# Altium project SNES_DRONE_V01.PrjPcb
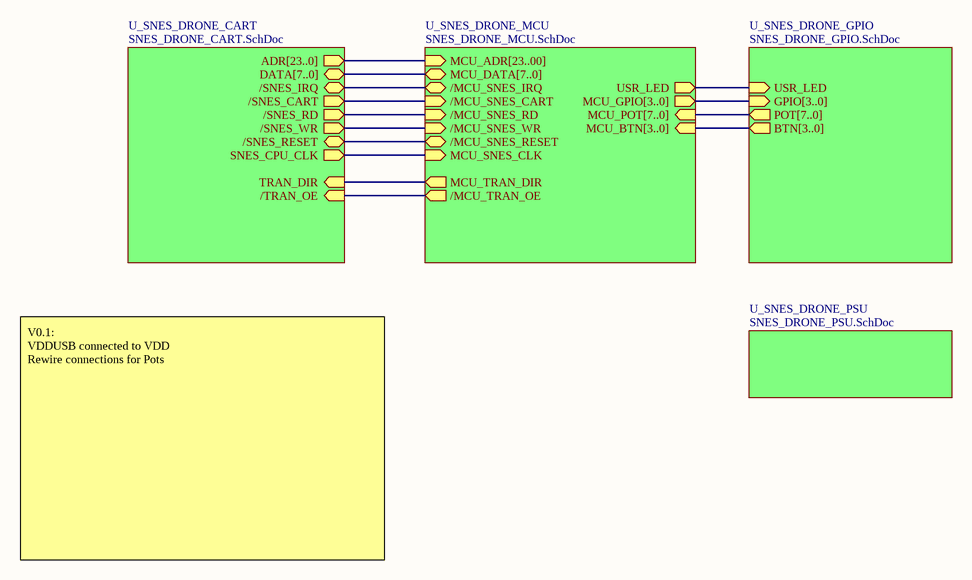
[diagram p0: SNES_DRONE_MAIN.SchDoc]
5 sheets, 102 parts. Net scope: hierarchical (ports join the sheet entries above them; power ports are global).
Board file: SNES_DRONE_PCB.PcbDoc
Sheets:
  SNES_DRONE_MAIN.SchDoc
    U_SNES_DRONE_CART = SNES_DRONE_CART.SchDoc
    U_SNES_DRONE_GPIO = SNES_DRONE_GPIO.SchDoc
    U_SNES_DRONE_MCU = SNES_DRONE_MCU.SchDoc
    U_SNES_DRONE_PSU = SNES_DRONE_PSU.SchDoc

## Sheet SNES_DRONE_MAIN.SchDoc
size A4

### Sub-sheets
U_SNES_DRONE_CART = SNES_DRONE_CART.SchDoc: DATA[7..0] (bidir), ADR[23..0] (out), /SNES_CART (out), /SNES_RD (out), /SNES_WR (out), SNES_CPU_CLK (out), TRAN_DIR (in), /TRAN_OE (in), /SNES_IRQ (bidir), /SNES_RESET (bidir)
U_SNES_DRONE_GPIO = SNES_DRONE_GPIO.SchDoc: POT[7..0] (out), BTN[3..0] (out), GPIO[3..0] (in), USR_LED (in)
U_SNES_DRONE_MCU = SNES_DRONE_MCU.SchDoc: MCU_ADR[23..00] (in), MCU_DATA[7..0] (bidir), /MCU_TRAN_OE (out), MCU_TRAN_DIR (out), /MCU_SNES_CART (in), /MCU_SNES_RD (in), /MCU_SNES_WR (in), MCU_SNES_CLK (in), MCU_POT[7..0] (in), USR_LED (out), MCU_GPIO[3..0] (out), MCU_BTN[3..0] (in), /MCU_SNES_IRQ (bidir), /MCU_SNES_RESET (bidir)
U_SNES_DRONE_PSU = SNES_DRONE_PSU.SchDoc: no entries

### Nets
MCU_USR_LED: sheet U_SNES_DRONE_GPIO/USR_LED, sheet U_SNES_DRONE_MCU/USR_LED
NetJ1_18: sheet U_SNES_DRONE_CART//SNES_IRQ, sheet U_SNES_DRONE_MCU//MCU_SNES_IRQ
NetJ1_23: sheet U_SNES_DRONE_CART//SNES_RD, sheet U_SNES_DRONE_MCU//MCU_SNES_RD
NetJ1_26: sheet U_SNES_DRONE_CART//SNES_RESET, sheet U_SNES_DRONE_MCU//MCU_SNES_RESET
NetJ1_49: sheet U_SNES_DRONE_CART//SNES_CART, sheet U_SNES_DRONE_MCU//MCU_SNES_CART
NetJ1_54: sheet U_SNES_DRONE_CART//SNES_WR, sheet U_SNES_DRONE_MCU//MCU_SNES_WR
NetJ1_57: sheet U_SNES_DRONE_CART/SNES_CPU_CLK, sheet U_SNES_DRONE_MCU/MCU_SNES_CLK
NetU2_35: sheet U_SNES_DRONE_CART//TRAN_OE, sheet U_SNES_DRONE_MCU//MCU_TRAN_OE
NetU2_36: sheet U_SNES_DRONE_CART/TRAN_DIR, sheet U_SNES_DRONE_MCU/MCU_TRAN_DIR

### Buses and harness runs
bus sheet U_SNES_DRONE_CART/ADR[23..0] = sheet U_SNES_DRONE_MCU/MCU_ADR[23..00]
bus sheet U_SNES_DRONE_CART/DATA[7..0] = sheet U_SNES_DRONE_MCU/MCU_DATA[7..0]
bus sheet U_SNES_DRONE_GPIO/BTN[3..0] = sheet U_SNES_DRONE_MCU/MCU_BTN[3..0]
bus sheet U_SNES_DRONE_GPIO/GPIO[3..0] = sheet U_SNES_DRONE_MCU/MCU_GPIO[3..0]
bus sheet U_SNES_DRONE_GPIO/POT[7..0] = sheet U_SNES_DRONE_MCU/MCU_POT[7..0]

### Notes on the sheet
- V0.1:
  VDDUSB connected to VDD
  Rewire connections for Pots

## Sheet SNES_DRONE_CART.SchDoc
size A4
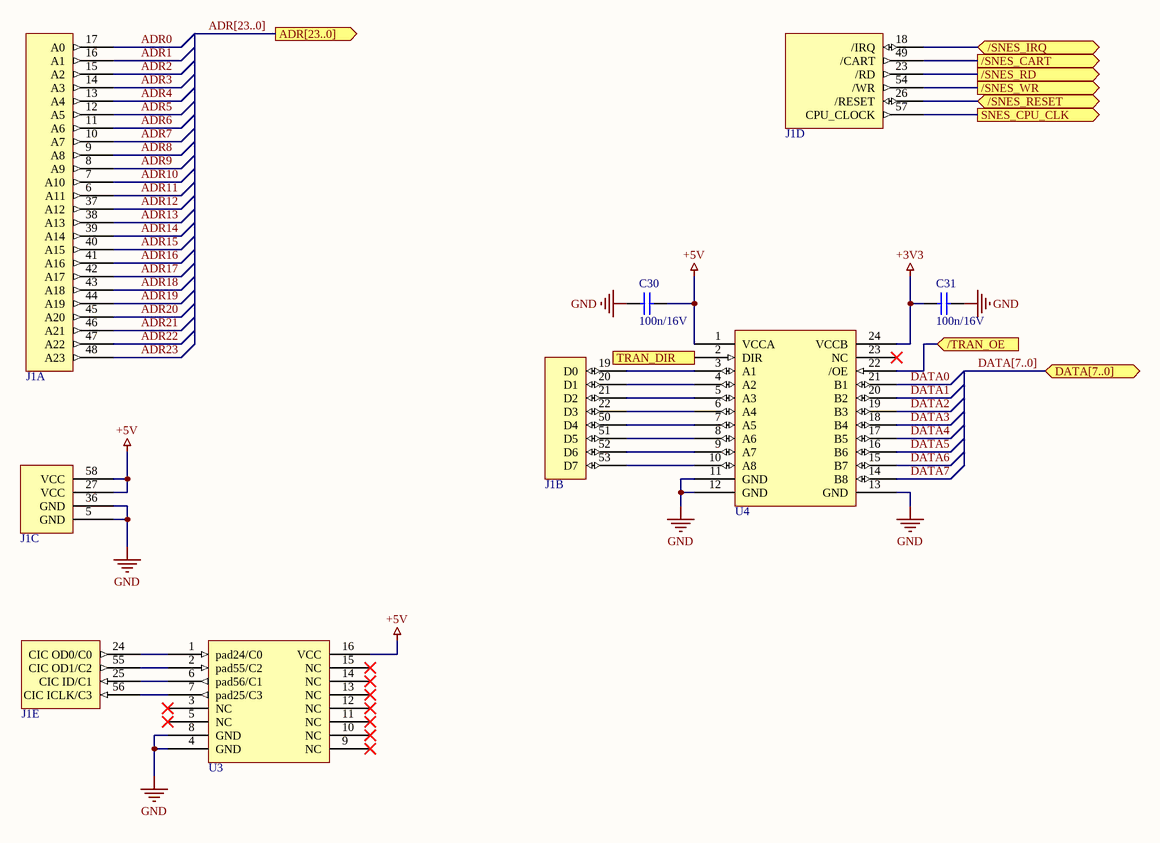
[diagram p1: SNES_DRONE_CART.SchDoc]

### Parts
C30  100n/16V  [0402_RES]
C31  100n/16V  [0402_RES]
J1  SNES Cartridge Connector  [SNES Cartridge Connector]  (value not drawn)  (parts A,B,C,D,E of 5)  (net tie, no BOM)
U3  IC_D411A  [DIP16]  (value not drawn)  (net tie, no BOM)
U4  IC_SN74LVCC3245APWR  [TSSOP24]  (value not drawn)

### Ports
/SNES_CART (out), /SNES_IRQ (bidir), /SNES_RD (out), /SNES_RESET (bidir), /SNES_WR (out), /TRAN_OE (in), ADR[23..0] (out), DATA[7..0] (bidir), SNES_CPU_CLK (out), TRAN_DIR (in)

### Nets
+3V3: C31.1 U4.24(VCCB)
+5V: C30.2 J1.27(VCC) J1.58(VCC) U3.16(VCC) U4.1(VCCA)
GND: C30.1 C31.2 J1.5(GND) J1.36(GND) U3.4(GND) U3.8(GND) U4.11(GND) U4.12(GND) U4.13(GND)
ADR0: J1.17(A0)
ADR1: J1.16(A1)
ADR2: J1.15(A2)
ADR3: J1.14(A3)
ADR4: J1.13(A4)
ADR5: J1.12(A5)
ADR6: J1.11(A6)
ADR7: J1.10(A7)
ADR8: J1.9(A8)
ADR9: J1.8(A9)
ADR10: J1.7(A10)
ADR11: J1.6(A11)
ADR12: J1.37(A12)
ADR13: J1.38(A13)
ADR14: J1.39(A14)
ADR15: J1.40(A15)
ADR16: J1.41(A16)
ADR17: J1.42(A17)
ADR18: J1.43(A18)
ADR19: J1.44(A19)
ADR20: J1.45(A20)
ADR21: J1.46(A21)
ADR22: J1.47(A22)
ADR23: J1.48(A23)
DATA0: U4.21(B1)
DATA1: U4.20(B2)
DATA2: U4.19(B3)
DATA3: U4.18(B4)
DATA4: U4.17(B5)
DATA5: U4.16(B6)
DATA6: U4.15(B7)
DATA7: U4.14(B8)
NetJ1_18: J1.18(/IRQ) ; port /SNES_IRQ
NetJ1_19: J1.19(D0) U4.3(A1)
NetJ1_20: J1.20(D1) U4.4(A2)
NetJ1_21: J1.21(D2) U4.5(A3)
NetJ1_22: J1.22(D3) U4.6(A4)
NetJ1_23: J1.23(/RD) ; port /SNES_RD
NetJ1_24: J1.24(CIC_OD0/C0) U3.1(pad24/C0)
NetJ1_25: J1.25(CIC_ID/C1) U3.6(pad56/C1)
NetJ1_26: J1.26(/RESET) ; port /SNES_RESET
NetJ1_49: J1.49(/CART) ; port /SNES_CART
NetJ1_50: J1.50(D4) U4.7(A5)
NetJ1_51: J1.51(D5) U4.8(A6)
NetJ1_52: J1.52(D6) U4.9(A7)
NetJ1_53: J1.53(D7) U4.10(A8)
NetJ1_54: J1.54(/WR) ; port /SNES_WR
NetJ1_55: J1.55(CIC_OD1/C2) U3.2(pad55/C2)
NetJ1_56: J1.56(CIC_ICLK/C3) U3.7(pad25/C3)
NetJ1_57: J1.57(CPU_CLOCK) ; port SNES_CPU_CLK
NetU2_35: U4.22(/OE) ; port /TRAN_OE
NetU2_36: U4.2(DIR) ; port TRAN_DIR

Not connected (* = marked no-connect by the designer): U3 3(NC)* 5(NC)* 9(NC)* 10(NC)* 11(NC)* 12(NC)* 13(NC)* 14(NC)* 15(NC)*; U4 23(NC)*

### Buses and harness runs
bus ADR[23..0] = port ADR[23..0]
bus DATA[7..0] = port DATA[7..0]

### Library data of the parts
C30 C31 = Cap_100n_0402: Keramikvielschichtkondensator, SMD, 0.1 µF, 16 V, 0402 [Metrisch 1005], ± 10%, X5R, Baureihe MC; Manufacturer Part Number 1: MC0402X104K160CT; Manufacturer 1: MULTICOMP; farnell number: 1759388; datasheet: http://www.farnell.com/datasheets/2046096.pdf?_ga=2.184862249.1080119096.1514547302-1693477411.1514385574; Supplier Unit Price 1: 0,0226; Supplier Order Qty 1: 10; ComponentLink1Description: datasheet; ComponentLink1URL: http://www.farnell.com/datasheets/1901289.pdf?_ga=2.126104776.453785206.1540794792-1293375253.1539206166; ComponentLink2Description: farnell; ComponentLink2URL: https://at.farnell.com/multicomp/mc0402x104k160ct/kondensator-0-1-f-16v-10-x5r-0402/dp/1759388?st=1%C2%B5F%20SMD; Supplier 1: Farnell; Supplier Part Number 1: 1760121; Value: 100n/16V
U3 = IC_D411A: SNES CIC Chip; ComponentLink1Description: info; ComponentLink1URL: https://wiki.superfamicom.org/cic
U4 = IC_SN74LVCC3245APWR: Bus-Transceiver, Produktreihe LVC, 8 Eingänge, 50mA, 7ns, 2.3V bis 5.5V, TSSOP 24; Manufacturer 1: TEXAS INSTRUMENTS; ComponentLink3Description: datsheet; ComponentLink3URL: http://www.ti.com/lit/ds/symlink/sn74lvcc3245a.pdf; ComponentLink4Description: farnell; ComponentLink4URL: https://at.farnell.com/texas-instruments/sn74lvcc3245apwr/bus-transceiver-8bit-tssop-24/dp/2854646?rpsku=rel3%3A2119962&st=2119962; Supplier 1: Farnell; Supplier Part Number 1: 2854646; Manufacturer Part Number 1: SN74LVCC3245APWR; Supplier Unit Price 1: 0,99; Supplier Order Qty 1: 1

## Sheet SNES_DRONE_GPIO.SchDoc
size A4
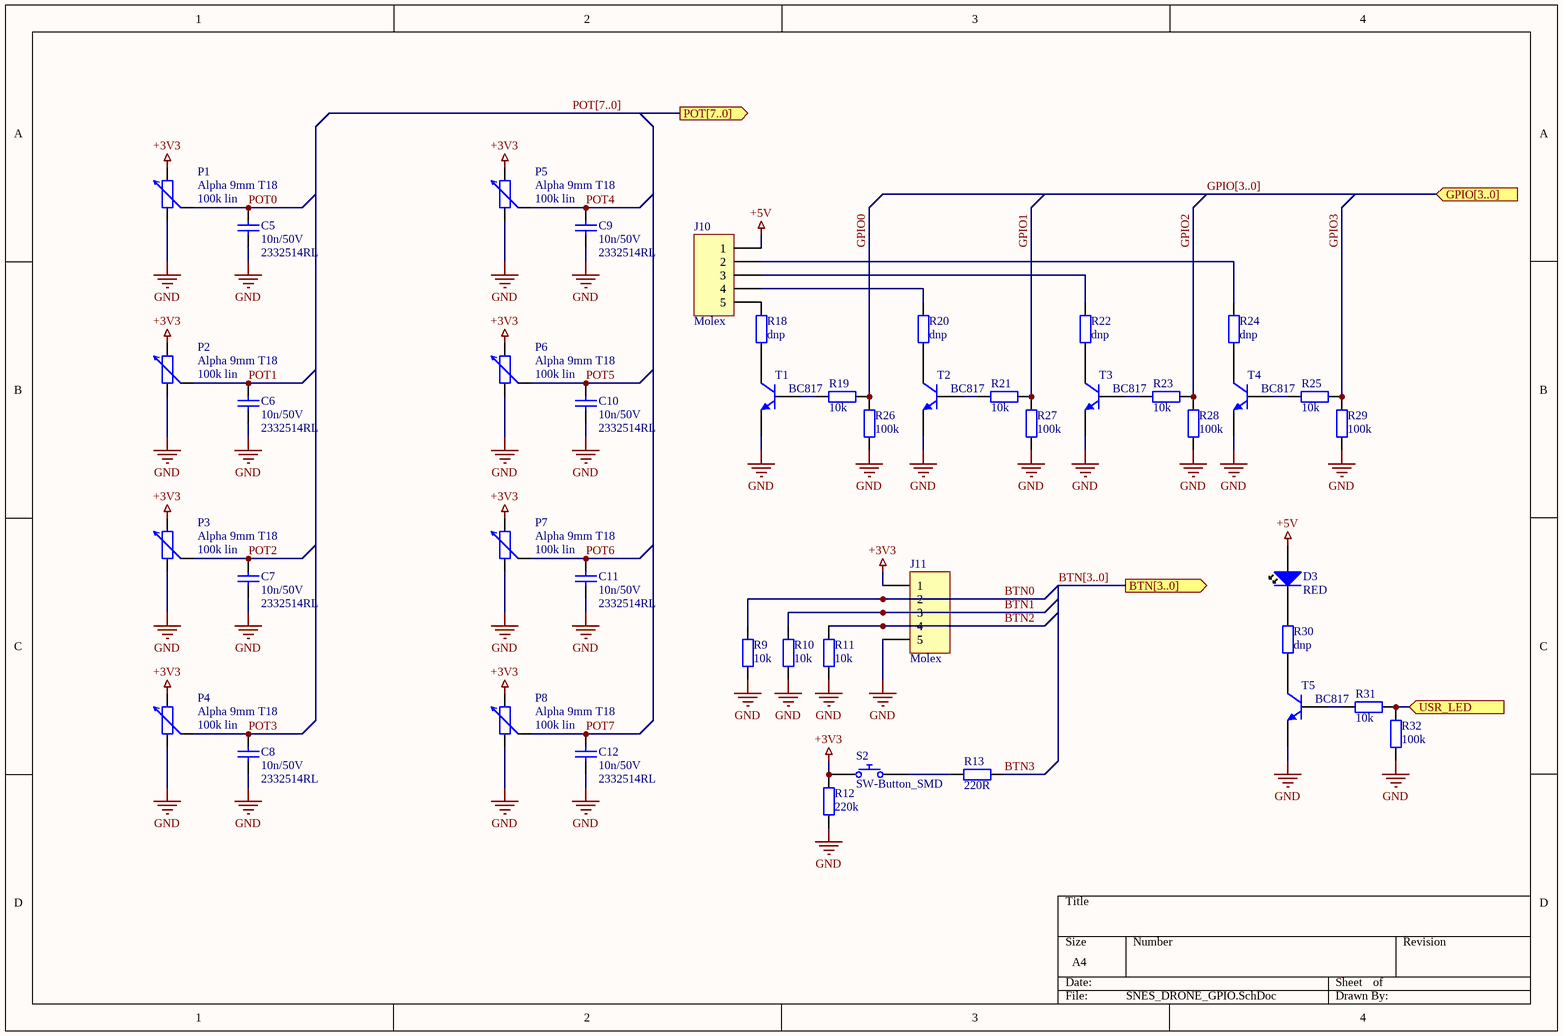
[diagram p2: SNES_DRONE_GPIO.SchDoc]

### Parts
C5  Supplier Part Number 1: 2332514RL  [0402_RES]  (hidden comment: 10n/50V)
C6  Supplier Part Number 1: 2332514RL  [0402_RES]  (hidden comment: 10n/50V)
C7  Supplier Part Number 1: 2332514RL  [0402_RES]  (hidden comment: 10n/50V)
C8  Supplier Part Number 1: 2332514RL  [0402_RES]  (hidden comment: 10n/50V)
C9  Supplier Part Number 1: 2332514RL  [0402_RES]  (hidden comment: 10n/50V)
C10  Supplier Part Number 1: 2332514RL  [0402_RES]  (hidden comment: 10n/50V)
C11  Supplier Part Number 1: 2332514RL  [0402_RES]  (hidden comment: 10n/50V)
C12  Supplier Part Number 1: 2332514RL  [0402_RES]  (hidden comment: 10n/50V)
D3  value RED  [0603_LED]  (hidden comment: RED LED)
J10  Manufacturer 1: Molex  [MOLEX_22-27-2051]  (hidden comment: MOLEX_22-27-2051)
J11  Manufacturer 1: Molex  [MOLEX_22-27-2051]  (hidden comment: MOLEX_22-27-2051)
P1  value 100k lin  Name: Alpha 9mm T18  [ALPHA_T18]  (hidden comment: RES_POT_100k_LIN_ALPHA_EURACK)
P2  value 100k lin  Name: Alpha 9mm T18  [ALPHA_T18]  (hidden comment: RES_POT_100k_LIN_ALPHA_EURACK)
P3  value 100k lin  Name: Alpha 9mm T18  [ALPHA_T18]  (hidden comment: RES_POT_100k_LIN_ALPHA_EURACK)
P4  value 100k lin  Name: Alpha 9mm T18  [ALPHA_T18]  (hidden comment: RES_POT_100k_LIN_ALPHA_EURACK)
P5  value 100k lin  Name: Alpha 9mm T18  [ALPHA_T18]  (hidden comment: RES_POT_100k_LIN_ALPHA_EURACK)
P6  value 100k lin  Name: Alpha 9mm T18  [ALPHA_T18]  (hidden comment: RES_POT_100k_LIN_ALPHA_EURACK)
P7  value 100k lin  Name: Alpha 9mm T18  [ALPHA_T18]  (hidden comment: RES_POT_100k_LIN_ALPHA_EURACK)
P8  value 100k lin  Name: Alpha 9mm T18  [ALPHA_T18]  (hidden comment: RES_POT_100k_LIN_ALPHA_EURACK)
R9  value 10k  [0603_RES]  (hidden comment: 10kOhm 100mW)
R10  value 10k  [0603_RES]  (hidden comment: 10kOhm 100mW)
R11  value 10k  [0603_RES]  (hidden comment: 10kOhm 100mW)
R12  value 220k  [0603_RES]  (hidden comment: 220kOhm 100mW)
R13  value 220R  [0603_RES]  (hidden comment: 220Ohm 100mW)
R18  DNP  [0603_DNP]  (no BOM)
R19  value 10k  [0603_RES]  (hidden comment: 10kOhm 100mW)
R20  DNP  [0603_DNP]  (no BOM)
R21  value 10k  [0603_RES]  (hidden comment: 10kOhm 100mW)
R22  DNP  [0603_DNP]  (no BOM)
R23  value 10k  [0603_RES]  (hidden comment: 10kOhm 100mW)
R24  DNP  [0603_DNP]  (no BOM)
R25  value 10k  [0603_RES]  (hidden comment: 10kOhm 100mW)
R26  value 100k  [0603_RES]  (hidden comment: 100kOhm 100mW)
R27  value 100k  [0603_RES]  (hidden comment: 100kOhm 100mW)
R28  value 100k  [0603_RES]  (hidden comment: 100kOhm 100mW)
R29  value 100k  [0603_RES]  (hidden comment: 100kOhm 100mW)
R30  DNP  [0603_DNP]  (no BOM)
R31  value 10k  [0603_RES]  (hidden comment: 10kOhm 100mW)
R32  value 100k  [0603_RES]  (hidden comment: 100kOhm 100mW)
S2  SW-Button_SMD  [SKQGAFE010]
T1  BC817  [TO-236AB]
T2  BC817  [TO-236AB]
T3  BC817  [TO-236AB]
T4  BC817  [TO-236AB]
T5  BC817  [TO-236AB]

### Ports
BTN[3..0] (out), GPIO[3..0] (in), POT[7..0] (out), USR_LED (in)

### Nets
+3V3: J11.1 P1.1 P2.1 P3.1 P4.1 P5.1 P6.1 P7.1 P8.1 R12.2 S2.3
+5V: D3.1(A) J10.1
GND: C5.1 C6.1 C7.1 C8.1 C9.1 C10.1 C11.1 C12.1 J11.5 P1.3 P2.3 P3.3 P4.3 P5.3 P6.3 P7.3 P8.3 R9.1 R10.1 R11.1 R12.1 R26.1 R27.1 R28.1 R29.1 R32.1 T1.2 T2.2 T3.2 T4.2 T5.2
BTN0: J11.2 R9.2
BTN1: J11.3 R10.2
BTN2: J11.4 R11.2
BTN3: R13.2
GPIO0: R19.1 R26.2
GPIO1: R21.1 R27.2
GPIO2: R23.1 R28.2
GPIO3: R25.1 R29.2
MCU_USR_LED: R31.1 R32.2 ; port USR_LED
POT0: C5.2 P1.2  [project net MCU_POT0]
POT1: C6.2 P2.2  [project net MCU_POT1]
POT2: C7.2 P3.2  [project net MCU_POT2]
POT3: C8.2 P4.2  [project net MCU_POT3]
POT4: C9.2 P5.2  [project net MCU_POT4]
POT5: C10.2 P6.2  [project net MCU_POT5]
POT6: C11.2 P7.2  [project net MCU_POT6]
POT7: C12.2 P8.2  [project net MCU_POT7]
NetD3_2: D3.2(K) R30.2
NetJ10_2: J10.2 R24.2
NetJ10_3: J10.3 R22.2
NetJ10_4: J10.4 R20.2
NetJ10_5: J10.5 R18.2
NetR13_1: R13.1 S2.1
NetR18_1: R18.1 T1.3
NetR19_2: R19.2 T1.1
NetR20_1: R20.1 T2.3
NetR21_2: R21.2 T2.1
NetR22_1: R22.1 T3.3
NetR23_2: R23.2 T3.1
NetR24_1: R24.1 T4.3
NetR25_2: R25.2 T4.1
NetR30_1: R30.1 T5.3
NetR31_2: R31.2 T5.1

### Buses and harness runs
bus BTN[3..0] = port BTN[3..0]
bus GPIO[3..0] = port GPIO[3..0]
bus POT[7..0] = port POT[7..0]

### Library data of the parts
C5-C12 = Cap_10n_0402: Keramikvielschichtkondensator, SMD, 10000 pF, 50 V, 0402 [Metrisch 1005], ± 10%, X7R, AVX 0402 MLCC; Manufacturer Part Number 1: 04025C103KAT2A; farnell number: 2332514; datasheet: http://www.farnell.com/datasheets/2237835.pdf?_ga=2.110684748.876692561.1541506444-1931041576.1541506444; Supplier Unit Price 1: 0,0689; Supplier Order Qty 1: 10; Supplier 1: Farnell; ComponentLink1Description: farnell; ComponentLink1URL: https://at.farnell.com/avx/04025c103kat2a/kondensator-0-01-f-50v-10-x7r/dp/2332514; ComponentLink2Description: datasheet; ComponentLink2URL: http://www.farnell.com/datasheets/2237835.pdf?_ga=2.156697970.876692561.1541506444-1931041576.1541506444; Manufacturer 1: AVX; Value: 10n/50V
D3 = LED_RED_0603: RED SMD 0603 LED 20mA 2V 0.04W; Manufacturer 1: KINGBRIGHT; Manufacturer Part Number 1: KPT-1608EC; farnell number: 2099221; datasheet: http://www.farnell.com/datasheets/2045911.pdf?_ga=2.71890899.197329085.1542397831-1931041576.1541506444; Supplier Order Qty 1: 5; Supplier Unit Price 1: 0,0686; Supplier 1: Farnell; ComponentLink1Description: datasheet; ComponentLink1URL: http://www.farnell.com/datasheets/2045911.pdf?_ga=2.71890899.197329085.1542397831-1931041576.1541506444; ComponentLink2Description: farnell; ComponentLink2URL: https://at.farnell.com/kingbright/kpt-1608ec/led-rot-0603-smd/dp/2099221; Supplier Part Number 1: 2099221RL
J10 J11 = MOLEX_22-27-2051: 5 pin molex connector; farnell number: 9731679; Supplier Unit Price 1: 0,271; datasheet: http://www.farnell.com/datasheets/2266141.pdf?_ga=2.175065506.1080119096.1514547302-1693477411.1514385574; Manufacturer Part Number 1: 22-27-2051; Supplier 1: Farnell; ComponentLink1Description: datasheet; ComponentLink1URL: http://www.farnell.com/datasheets/1861453.pdf?_ga=2.126244552.471268527.1516457893-947204359.1516457893; ComponentLink2Description: farnell; ComponentLink2URL: http://at.farnell.com/molex/22-27-2051/header-square-pin-0-1zoll-5way/dp/9731679?ost=9731679&ddkey=http%3Ade-AT%2FElement14_Austria%2Fsearch; Supplier Part Number 1: 9731679; Supplier Order Qty 1: 10; Value: *
P1-P8 = RES_POT_100k_LIN_ALPHA_EURACK: Shaft Diameter – 6mm (0.2″) / Shaft Length – 15mm (0.59″); Manufacturer 1: Alpha; Manufacturer Part Number 1: SP17090051; ComponentLink1Description: thonk; ComponentLink1URL: https://www.thonk.co.uk/shop/alpha-9mm-pots-vertical-t18/; Supplier 1: Thonk; Supplier Part Number 1: Alpha 9mm Pots; Supplier Order Qty 1: 1; Supplier Unit Price 1: 1,99; ComponentLink2Description: datasheet; ComponentLink2URL: https://www.thonk.co.uk/wp-content/uploads/2017/12/Alpha-9mm-Vertical-T18-RD901F-40-15K-B50K-0057.pdf
R9-R11 R19 R21 R23 R25 R31 = RES_0603_10k_100mW: YAGEO 10kOhm 100mW ± 1%; Manufacturer Part Number 1: RC0603JR-0710KL; Suppler Unit Price 1: 0,0195; Supplier Order Qty 1: 10; Supplier 1: Farnell; ComponentLink1Description: datasheet; ComponentLink1URL: http://www.farnell.com/datasheets/2167052.pdf?_ga=2.236107713.197329085.1542397831-1931041576.1541506444; ComponentLink2Description: farnell; ComponentLink2URL: https://at.farnell.com/yageo/rc0603jr-0710kl/dickschichtwiderstand-10k-5-0/dp/9233504; Supplier Part Number 1: 9233504RL; Manufacturer 1: YAGEO
R12 = RES_0603_220k_100mW: VISHAY 220kOhm 100mW ± 1%; Manufacturer Part Number 1: CRCW0603220KFKEA; Suppler Unit Price 1: 0,021; Supplier Order Qty 1: 10; Supplier 1: Farnell; ComponentLink1Description: datasheet; ComponentLink1URL: http://www.farnell.com/datasheets/2310790.pdf?_ga=2.144355573.197329085.1542397831-1931041576.1541506444; ComponentLink2Description: farnell; ComponentLink2URL: https://at.farnell.com/vishay/crcw0603220kfkea/dickschichtwiderstand-220k-1-0/dp/1469783; Manufacturer 1: VISHAY; Supplier Part Number 1: 2122659
R13 = RES_0603_220_100mW: YAGEO 220Ohm 100mW ± 1%; Manufacturer Part Number 1: RC0603JR-07220RL; Suppler Unit Price 1: 0,053; Supplier Order Qty 1: 10; Supplier 1: Farnell; ComponentLink1Description: datasheet; ComponentLink1URL: http://www.farnell.com/datasheets/2167052.pdf?_ga=2.63044847.197329085.1542397831-1931041576.1541506444; ComponentLink2Description: farnell; ComponentLink2URL: https://at.farnell.com/yageo/rc0603jr-07220rl/dickschichtwiderstand-220r-5-0/dp/9233296; Manufacturer 1: YAGEO; Supplier Part Number 1: 9233296RL
R18 R20 R22 R24 R30 = RES_DNP: Value: dnp
R26-R29 R32 = RES_0603_100k_100mW: WALSIN 6.8kOhm 100mW 75 ± 1%; Manufacturer 1: YAGEO; Manufacturer Part Number 1: RC0603FR-13100KL; Suppler Unit Price 1: 0,0156; datasheet: http://www.farnell.com/datasheets/1960319.pdf?_ga=2.194175406.2061832810.1527062369-1851341051.1526919624; price: 0,0156; Supplier Order Qty 1: 1; Supplier 1: Farnell; ComponentLink1Description: farnell; ComponentLink1URL: http://at.farnell.com/yageo/rc0603fr-13100kl/dickschichtwiderstand-100k-1-0/dp/2309107?ost=2309107&scope=partnumberlookahead&exaMfpn=true&searchref=searchlookahead&ddkey=http%3Ade-AT%2FElement14_Austria%2Fw%2Fsearch; ComponentLink2Description: datasheet; ComponentLink2URL: http://www.farnell.com/datasheets/2167052.pdf?_ga=2.98118940.2061832810.1527062369-1851341051.1526919624; Supplier Part Number 1: 1799369
S2 = SW-Button_SMD: ALPS SMD Push Button; Supplier 1: Farnell; ComponentLink1Description: datasheet; ComponentLink1URL: http://www.farnell.com/datasheets/1582326.pdf?_ga=2.174774114.197329085.1542397831-1931041576.1541506444; ComponentLink2Description: farnell; ComponentLink2URL: https://at.farnell.com/alps/skqgafe010/taster-smd-0-98n-5-2x5-2mm/dp/2056843; Supplier Part Number 1: 2056843RL; Manufacturer 1: ALPS; Manufacturer Part Number 1: SKQGAFE010; Supplier Order Qty 1: 10; Supplier Unit Price 1: 0,544
T1-T5 = BJT_NPN_BC817: BJT, NPN, 45 V, 250 mW, 500 mA, 160 hFE; Manufacturer 1: NEXPERIA; Manufacturer Part Number 1: BC817-25,215; farnell number: 1081224; datasheet: http://www.farnell.com/datasheets/1913545.pdf?_ga=2.172501667.1080119096.1514547302-1693477411.1514385574; Supplier Order Qty 1: 5; Value: *; Supplier Unit Price 1: 0,123; ComponentLink1Description: datasheet; ComponentLink1URL: http://www.farnell.com/datasheets/699988.pdf?_ga=2.152104250.2061832810.1527062369-1851341051.1526919624; ComponentLink2Description: farnell; ComponentLink2URL: http://at.farnell.com/nexperia/bc817-25-215/bipolartransistor-npn-45v-0-5a/dp/1081224?ost=1081224&scope=partnumberlookahead&exaMfpn=true&searchref=searchlookahead&ddkey=http%3Ade-AT%2FElement14_Austria%2Fw%2Fsearch; Supplier 1: Farnell; Supplier Part Number 1: 2336779

## Sheet SNES_DRONE_MCU.SchDoc
size A4
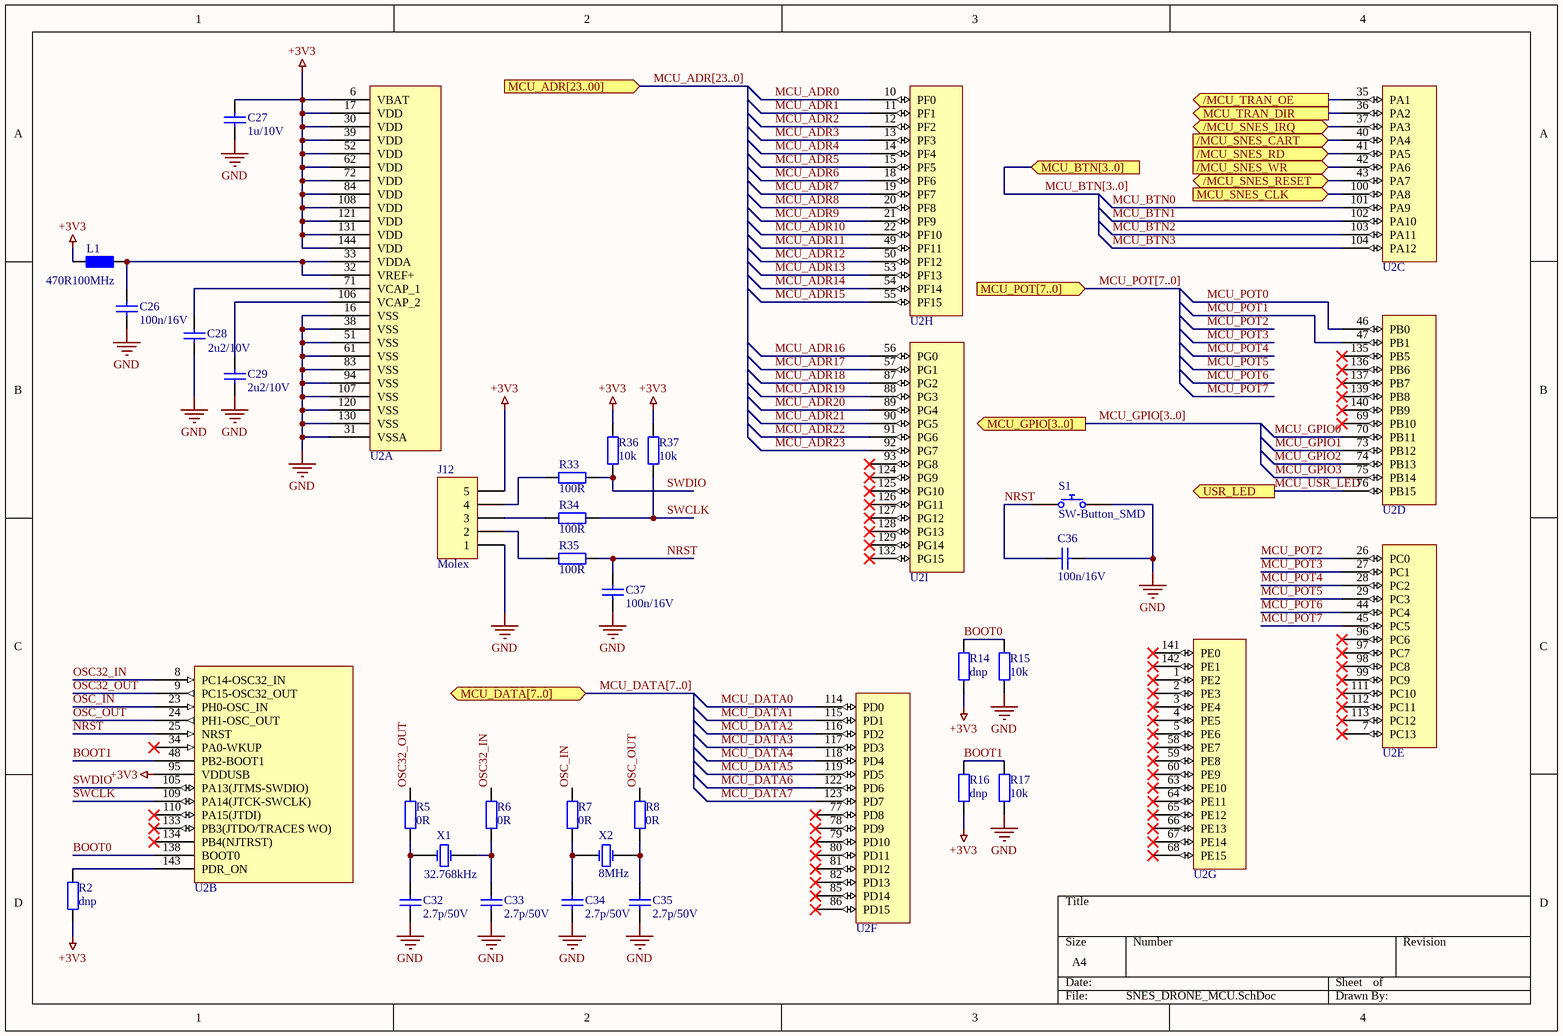
[diagram p3: SNES_DRONE_MCU.SchDoc]

### Parts
C26  100n/16V  [0402_RES]
C27  1u/10V  [0603_RES]
C28  2u2/10V  [0603_RES]
C29  2u2/10V  [0603_RES]
C32  2.7p/50V  [0402_RES]
C33  2.7p/50V  [0402_RES]
C34  2.7p/50V  [0402_RES]
C35  2.7p/50V  [0402_RES]
C36  100n/16V  [0402_RES]
C37  100n/16V  [0402_RES]
J12  Manufacturer 1: Molex  [MOLEX_22-27-2051]  (hidden comment: MOLEX_22-27-2051)
L1  470R100MHz  [0603_RES]
R2  DNP  [0603_DNP]  (no BOM)
R5  0R  [0603_RES]
R6  0R  [0603_RES]
R7  0R  [0603_RES]
R8  0R  [0603_RES]
R14  DNP  [0603_DNP]  (no BOM)
R15  value 10k  [0603_RES]  (hidden comment: 10kOhm 100mW)
R16  DNP  [0603_DNP]  (no BOM)
R17  value 10k  [0603_RES]  (hidden comment: 10kOhm 100mW)
R33  value 100R  [0603_RES]  (hidden comment: 100Ohm 100mW)
R34  value 100R  [0603_RES]  (hidden comment: 100Ohm 100mW)
R35  value 100R  [0603_RES]  (hidden comment: 100Ohm 100mW)
R36  value 10k  [0603_RES]  (hidden comment: 10kOhm 100mW)
R37  value 10k  [0603_RES]  (hidden comment: 10kOhm 100mW)
S1  SW-Button_SMD  [SKQGAFE010]
U2  STM32F446ZE  [LQFP144_SMALL_PADS]  (value not drawn)  (parts A,B,C,D,E,F,G,H,I of 9)
X1  32.768kHz  [XTAL_32768khz]
X2  8MHz  [XTAL_8MHZ]

### Ports
/MCU_SNES_CART (in), /MCU_SNES_IRQ (bidir), /MCU_SNES_RD (in), /MCU_SNES_RESET (bidir), /MCU_SNES_WR (in), /MCU_TRAN_OE (out), MCU_ADR[23..00] (in), MCU_BTN[3..0] (in), MCU_DATA[7..0] (bidir), MCU_GPIO[3..0] (out), MCU_POT[7..0] (in), MCU_SNES_CLK (in), MCU_TRAN_DIR (out), USR_LED (out)

### Nets
+3V3: C27.2 J12.5 L1.1 R2.1 R14.1 R16.1 R36.2 R37.2 U2.6(VBAT) U2.17(VDD) U2.30(VDD) U2.39(VDD) U2.52(VDD) U2.62(VDD) U2.72(VDD) U2.84(VDD) U2.95(VDDUSB) U2.108(VDD) U2.121(VDD) U2.131(VDD) U2.144(VDD)
GND: C26.1 C27.1 C28.1 C29.1 C32.1 C33.1 C34.1 C35.1 C36.2 C37.1 J12.1 R15.1 R17.1 S1.3 U2.16(VSS) U2.31(VSSA) U2.38(VSS) U2.51(VSS) U2.61(VSS) U2.83(VSS) U2.94(VSS) U2.107(VSS) U2.120(VSS) U2.130(VSS)
BOOT0: R14.2 R15.2 U2.138(BOOT0)
BOOT1: R16.2 R17.2 U2.48(PB2-BOOT1)
MCU_ADR0: U2.10(PF0)  [project net ADR0]
MCU_ADR1: U2.11(PF1)  [project net ADR1]
MCU_ADR2: U2.12(PF2)  [project net ADR2]
MCU_ADR3: U2.13(PF3)  [project net ADR3]
MCU_ADR4: U2.14(PF4)  [project net ADR4]
MCU_ADR5: U2.15(PF5)  [project net ADR5]
MCU_ADR6: U2.18(PF6)  [project net ADR6]
MCU_ADR7: U2.19(PF7)  [project net ADR7]
MCU_ADR8: U2.20(PF8)  [project net ADR8]
MCU_ADR9: U2.21(PF9)  [project net ADR9]
MCU_ADR10: U2.22(PF10)  [project net ADR10]
MCU_ADR11: U2.49(PF11)  [project net ADR11]
MCU_ADR12: U2.50(PF12)  [project net ADR12]
MCU_ADR13: U2.53(PF13)  [project net ADR13]
MCU_ADR14: U2.54(PF14)  [project net ADR14]
MCU_ADR15: U2.55(PF15)  [project net ADR15]
MCU_ADR16: U2.56(PG0)  [project net ADR16]
MCU_ADR17: U2.57(PG1)  [project net ADR17]
MCU_ADR18: U2.87(PG2)  [project net ADR18]
MCU_ADR19: U2.88(PG3)  [project net ADR19]
MCU_ADR20: U2.89(PG4)  [project net ADR20]
MCU_ADR21: U2.90(PG5)  [project net ADR21]
MCU_ADR22: U2.91(PG6)  [project net ADR22]
MCU_ADR23: U2.92(PG7)  [project net ADR23]
MCU_BTN0: U2.101(PA9)  [project net BTN0]
MCU_BTN1: U2.102(PA10)  [project net BTN1]
MCU_BTN2: U2.103(PA11)  [project net BTN2]
MCU_BTN3: U2.104(PA12)  [project net BTN3]
MCU_DATA0: U2.114(PD0)  [project net DATA0]
MCU_DATA1: U2.115(PD1)  [project net DATA1]
MCU_DATA2: U2.116(PD2)  [project net DATA2]
MCU_DATA3: U2.117(PD3)  [project net DATA3]
MCU_DATA4: U2.118(PD4)  [project net DATA4]
MCU_DATA5: U2.119(PD5)  [project net DATA5]
MCU_DATA6: U2.122(PD6)  [project net DATA6]
MCU_DATA7: U2.123(PD7)  [project net DATA7]
MCU_GPIO0: U2.70(PB11)  [project net GPIO0]
MCU_GPIO1: U2.73(PB12)  [project net GPIO1]
MCU_GPIO2: U2.74(PB13)  [project net GPIO2]
MCU_GPIO3: U2.75(PB14)  [project net GPIO3]
MCU_POT0: U2.46(PB0)
MCU_POT1: U2.47(PB1)
MCU_POT2: U2.26(PC0)
MCU_POT3: U2.27(PC1)
MCU_POT4: U2.28(PC2)
MCU_POT5: U2.29(PC3)
MCU_POT6: U2.44(PC4)
MCU_POT7: U2.45(PC5)
MCU_USR_LED: U2.76(PB15) ; port USR_LED
NRST: C36.1 C37.2 R35.2 S1.1 U2.25(NRST)
OSC32_IN: R6.2 U2.8(PC14-OSC32_IN)
OSC32_OUT: R5.2 U2.9(PC15-OSC32_OUT)
OSC_IN: R7.2 U2.23(PH0-OSC_IN)
OSC_OUT: R8.2 U2.24(PH1-OSC_OUT)
SWCLK: R34.2 R37.1 U2.109(PA14(JTCK-SWCLK))
SWDIO: R33.2 R36.1 U2.105(PA13(JTMS-SWDIO))
NetC26_2: C26.2 L1.2 U2.32(VREF+) U2.33(VDDA)
NetC28_2: C28.2 U2.71(VCAP_1)
NetC29_2: C29.2 U2.106(VCAP_2)
NetC32_2: C32.2 R5.1 X1.1
NetC33_2: C33.2 R6.1 X1.2
NetC34_2: C34.2 R7.1 X2.1
NetC35_2: C35.2 R8.1 X2.2
NetJ1_18: U2.37(PA3) ; port /MCU_SNES_IRQ
NetJ1_23: U2.41(PA5) ; port /MCU_SNES_RD
NetJ1_26: U2.43(PA7) ; port /MCU_SNES_RESET
NetJ1_49: U2.40(PA4) ; port /MCU_SNES_CART
NetJ1_54: U2.42(PA6) ; port /MCU_SNES_WR
NetJ1_57: U2.100(PA8) ; port MCU_SNES_CLK
NetJ12_2: J12.2 R35.1
NetJ12_3: J12.3 R34.1
NetJ12_4: J12.4 R33.1
NetR2_2: R2.2 U2.143(PDR_ON)
NetU2_35: U2.35(PA1) ; port /MCU_TRAN_OE
NetU2_36: U2.36(PA2) ; port MCU_TRAN_DIR

Not connected (* = marked no-connect by the designer): U2 1(PE2)* 2(PE3)* 3(PE4)* 4(PE5)* 5(PE6)* 7(PC13)* 34(PA0-WKUP)* 58(PE7)* 59(PE8)* 60(PE9)* 63(PE10)* 64(PE11)* 65(PE12)* 66(PE13)* 67(PE14)* 68(PE15)* 69(PB10)* 77(PD8)* 78(PD9)* 79(PD10)* 80(PD11)* 81(PD12)* 82(PD13)* 85(PD14)* 86(PD15)* 93(PG8)* 96(PC6)* 97(PC7)* 98(PC8)* 99(PC9)* 110(PA15(JTDI))* 111(PC10)* 112(PC11)* 113(PC12)* 124(PG9)* 125(PG10)* 126(PG11)* 127(PG12)* 128(PG13)* 129(PG14)* 132(PG15)* 133(PB3(JTDO/TRACES_WO))* 134(PB4(NJTRST))* 135(PB5)* 136(PB6)* 137(PB7)* 139(PB8)* 140(PB9)* 141(PE0)* 142(PE1)*

### Buses and harness runs
bus MCU_ADR[23..0] = port MCU_ADR[23..00]
bus MCU_BTN[3..0] = port MCU_BTN[3..0]
bus MCU_DATA[7..0] = port MCU_DATA[7..0]
bus MCU_GPIO[3..0] = port MCU_GPIO[3..0]
bus MCU_POT[7..0] = port MCU_POT[7..0]

### Library data of the parts
C26 C36 C37 = Cap_100n_0402: as C30 on sheet SNES_DRONE_CART; farnell number: 1759388; datasheet: http://www.farnell.com/datasheets/2046096.pdf?_ga=2.184862249.1080119096.1514547302-1693477411.1514385574; Supplier Unit Price 1: 0,0226; Supplier Order Qty 1: 10; ComponentLink1Description: datasheet; ComponentLink1URL: http://www.farnell.com/datasheets/1901289.pdf?_ga=2.126104776.453785206.1540794792-1293375253.1539206166; ComponentLink2Description: farnell; ComponentLink2URL: https://at.farnell.com/multicomp/mc0402x104k160ct/kondensator-0-1-f-16v-10-x5r-0402/dp/1759388?st=1%C2%B5F%20SMD; Supplier 1: Farnell; Supplier Part Number 1: 1760121; Value: 100n/16V
C27 = Cap_1u_0603: Keramikvielschichtkondensator, SMD, 1 µF, 10 V, 0603 [Metrisch 1608], ± 20%, X5R, WCAP-CSGP Series; Manufacturer 1: WURTH ELEKTRONIK; Manufacturer Part Number 1: 885012106010; farnell number: 1166020; datasheet: http://www.farnell.com/datasheets/2046096.pdf?_ga=2.184862249.1080119096.1514547302-1693477411.1514385574; Supplier Unit Price 1: 0,0826; Supplier Order Qty 1: 10; ComponentLink1Description: datasheet; ComponentLink1URL: http://www.farnell.com/datasheets/2031757.pdf?_ga=2.58341487.453785206.1540794792-1293375253.1539206166; ComponentLink2Description: farnell; ComponentLink2URL: https://at.farnell.com/wurth-elektronik/885012106010/kondensator-1-f-10v-20-x5r-0603/dp/2533941?st=1%C2%B5F%20SMD; Supplier 1: Farnell; Supplier Part Number 1: 2533941; Value: 1u/10V
C28 C29 = Cap_2u2_0603: C1608X7R1A225K080AC -  Keramikvielschichtkondensator, SMD, 2.2 µF, 10 V, 0603 [Metrisch 1608], ± 10%, X7R, Baureihe C; Manufacturer 1: TDK; farnell number: 2346896; Supplier Unit Price 1: 0,177; Supplier Order Qty 1: 10; ComponentLink1Description: datasheet; ComponentLink1URL: http://www.farnell.com/datasheets/2291921.pdf?_ga=2.136060017.197329085.1542397831-1931041576.1541506444; ComponentLink2Description: farnell; ComponentLink2URL: https://at.farnell.com/tdk/c1608x7r1a225k080ac/kondensator-2-2-f-10v-10-x7r-0603/dp/2346896; Supplier 1: Farnell; Supplier Part Number 1: 2354341; Manufacturer Part Number 1: C1608X7R1A225K080AC; Value: 2u2/10V
C32-C35 = Cap_2p7_0402: Keramikvielschichtkondensator, SMD, 2.7 pF, 50 V, 0402 [Metrisch 1005], ± 0.25pF, C0G / NP0; Manufacturer 1: KEMET; Manufacturer Part Number 1: C0402C279C5GACTU; farnell number: 1865415; datasheet: http://www.farnell.com/datasheets/2046096.pdf?_ga=2.184862249.1080119096.1514547302-1693477411.1514385574; Supplier Unit Price 1: 0,0482; Supplier Order Qty 1: 10; ComponentLink1Description: datasheet; ComponentLink1URL: http://www.farnell.com/datasheets/2315001.pdf?_ga=2.24763903.453785206.1540794792-1293375253.1539206166; ComponentLink2Description: farnell; ComponentLink2URL: https://at.farnell.com/kemet/c0402c279c5gactu/kondensator-2-7pf-50v-c0g-np0/dp/1865415; Supplier 1: Farnell; Supplier Part Number 1: 8771367; Value: 2.7p/50V
J12 = MOLEX_22-27-2051: 5 pin molex connector; farnell number: 9731679; Supplier Unit Price 1: 0,271; datasheet: http://www.farnell.com/datasheets/2266141.pdf?_ga=2.175065506.1080119096.1514547302-1693477411.1514385574; Manufacturer Part Number 1: 22-27-2051; Supplier 1: Farnell; ComponentLink1Description: datasheet; ComponentLink1URL: http://www.farnell.com/datasheets/1861453.pdf?_ga=2.126244552.471268527.1516457893-947204359.1516457893; ComponentLink2Description: farnell; ComponentLink2URL: http://at.farnell.com/molex/22-27-2051/header-square-pin-0-1zoll-5way/dp/9731679?ost=9731679&ddkey=http%3Ade-AT%2FElement14_Austria%2Fsearch; Supplier Part Number 1: 9731679; Supplier Order Qty 1: 10; Value: *
L1 = FER_0603_470R: BLM18PG471SN1D -  Ferritperle, 0603 [Metrisch 1608], 470 ohm, 1 A, Baureihe BLM18P, 0.2 ohm, ± 25%; Manufacturer 1: MURATA; Suppler Unit Price 1: 0,0562; Supplier Order Qty 1: 10; Value: 470R100MHz; ComponentLink1Description: datasheet; ComponentLink1URL: http://www.farnell.com/datasheets/1740433.pdf?_ga=2.107600706.197329085.1542397831-1931041576.1541506444; ComponentLink2Description: farnell; ComponentLink2URL: https://at.farnell.com/murata/blm18pg471sn1d/ferrite-perle-0603-bauform-470ohm/dp/1515745?MER=bn_browse_1TP_MostPopular_1; Supplier 1: Farnell; Manufacturer Part Number 1: BLM18PG471SN1D; Supplier Part Number 1: 1515745RL
R2 R14 R16 = RES_DNP: Value: dnp
R5-R8 = RES_0603_0R: YAGEO 0R; Manufacturer Part Number 1: RC0603FR-070RL; Suppler Unit Price 1: 0,053; Supplier Order Qty 1: 10; Supplier 1: Farnell; ComponentLink1Description: datasheet; ComponentLink1URL: http://www.farnell.com/datasheets/1868787.pdf?_ga=2.169539809.197329085.1542397831-1931041576.1541506444; ComponentLink2Description: farnell; ComponentLink2URL: https://at.farnell.com/yageo/rc0603fr-070rl/dickschichtwiderstand-0r0-1-0/dp/2693558; Supplier Part Number 1: 2309106; Manufacturer 1: YAGEO; Value: 0R
R15 R17 R36 R37 = RES_0603_10k_100mW: as R9 on sheet SNES_DRONE_GPIO; Supplier Order Qty 1: 10; Supplier 1: Farnell; ComponentLink1Description: datasheet; ComponentLink1URL: http://www.farnell.com/datasheets/2167052.pdf?_ga=2.236107713.197329085.1542397831-1931041576.1541506444; ComponentLink2Description: farnell; ComponentLink2URL: https://at.farnell.com/yageo/rc0603jr-0710kl/dickschichtwiderstand-10k-5-0/dp/9233504; Supplier Part Number 1: 9233504RL; Manufacturer 1: YAGEO
R33-R35 = RES_0603_100_100mW: PANASONIC ELECTRONIC COMPONENTS 100Ohm 100mW ± 1%; Manufacturer Part Number 1: ERJ3EKF1000V; Suppler Unit Price 1: 0,053; Supplier Order Qty 1: 10; Supplier 1: Farnell; ComponentLink1Description: datasheet; ComponentLink1URL: http://www.farnell.com/datasheets/1911175.pdf?_ga=2.135975793.197329085.1542397831-1931041576.1541506444; ComponentLink2Description: farnell; ComponentLink2URL: https://at.farnell.com/panasonic-electronic-components/erj3ekf1000v/dickschichtwiderstand-100r-1-0/dp/2303059; Supplier Part Number 1: 2304564; Manufacturer 1: PANASONIC ELECTRONIC COMPONENTS
S1 = SW-Button_SMD: ALPS SMD Push Button; Supplier 1: Farnell; ComponentLink1Description: datasheet; ComponentLink1URL: http://www.farnell.com/datasheets/1582326.pdf?_ga=2.174774114.197329085.1542397831-1931041576.1541506444; ComponentLink2Description: farnell; ComponentLink2URL: https://at.farnell.com/alps/skqgafe010/taster-smd-0-98n-5-2x5-2mm/dp/2056843; Supplier Part Number 1: 2056843RL; Manufacturer 1: ALPS; Manufacturer Part Number 1: SKQGAFE010; Supplier Order Qty 1: 10; Supplier Unit Price 1: 0,544
U2 = STM32F446ZE: ARM Cortex-M4, 180MHz, 512KB, 128KB; Manufacturer 1: ST; Manufacturer Part Number 1: STM32F446ZET6; farnell number: 2535607; datasheet: http://www.farnell.com/datasheets/1913545.pdf?_ga=2.172501667.1080119096.1514547302-1693477411.1514385574; Supplier Order Qty 1: 5; Value: *; Supplier Unit Price 1: 0,914; ComponentLink1Description: datasheet; ComponentLink1URL: http://www.farnell.com/datasheets/2309063.pdf?_ga=2.211445013.1861125961.1540492103-1293375253.1539206166; ComponentLink2Description: farnell; ComponentLink2URL: https://at.farnell.com/stmicroelectronics/stm32f446zet6/mcu-32bit-cortex-m4-180mhz-lqfp/dp/2488317?ost=STM32F446ZET6&scope=partnumberlookahead&searchref=searchlookahead&krypto=c3kNjvKBdgDFfKBoyKQ7uBR8CcHN8OihP%2FFRmWmhnjqGKzkXdgHVEsC0KjPeQc4yhoNBdiRdvz1UNXoeZ%2Bj9Wls9Ou9qhpytzyrLSPkMbSzMdEC257%2FL94QRGGS5HHvaMslZO2Q7%2B6CdbVDy5GqmpX33KX1yJm4tp9dxxMEe1JMGz1J40K%2BG1giSzi911lbsFGEvkm%2B2OaJvWyaxtKR2mAyqWullap%2BAFNEvolJUG1EHPiy5cjnXeImhlfdZhtWBdLgHpejLEui5Q6y5U7L2NYvYUl3K5pituisIIykjMSPPvhjcMk3tWgIKuacRYgN8kxpcHrLkyaDLpzoP5T5NY%2BHR9SwopXidDHX9YI3Yb34Y3YXsCIKK8qKpz0zDmwafzwjYGEhxJbTR8qzPL%2BDUrkSJooKnNUI2RI4wv%2FqyRs36BnDpuxjqxlwlPyG%2BLBMeDOHMBNjHJC4brpI6hfLJj75Ajkn2U7w%2B31NVMZq3xrvyCIT%2B4tTT8Pu%2BR%2FG%2FjvegGvNF1Kbe90ARMvaGPJ5x6rIipkziu%2BsfsHaTJXClEq2NLmS%2FHmvLTHYQS1iCR0rt0zwDZQAJpIRPSuMTGAQvu7iD0LTYC7oHGR4HslyVtrM%3D&ddkey=https%3Ade-AT%2FElement14_Austria%2Fw%2Fsearch; ComponentLink3Description: STM; ComponentLink3URL: https://www.st.com/en/microcontrollers/stm32f446ze.html; Supplier 1: Farnell; Supplier Part Number 1: 2488317
X1 = XTAL_32.768kHz: AB38T-32.768KHZ -  Quarz, 32.768 kHz, Zylinder, radial bedrahtet, 8.2mm x 3.2mm Durchm., 12.5 pF, 20 ppm; Manufacturer 1: ABRACON; Supplier Unit Price 1: 0,167; Supplier Order Qty 1: 1; Value: 32.768kHz; ComponentLink1Description: datasheet; ComponentLink1URL: http://www.farnell.com/datasheets/1883667.pdf?_ga=2.68425681.197329085.1542397831-1931041576.1541506444; ComponentLink2Description: farnell; ComponentLink2URL: https://at.farnell.com/abracon/ab38t-32-768khz/quarz-32-768khz-12-5pf-uhr-a/dp/1611828; Supplier 1: Farnell; Supplier Part Number 1: 1611828; Manufacturer Part Number 1: AB38T-32.768KHZ
X2 = XTAL_8MHz: 9B-8.000MAAJ-B -  Quarz, 8 MHz, Durchsteckmontage, 11.5mm x 5mm, 30 ppm, 18 pF, 30 ppm, Baureihe 9B; Manufacturer 1: TXC; ComponentLink1Description: farnell; ComponentLink1URL: https://at.farnell.com/txc/9b-8-000maaj-b/xtal-8-000mhz-18pf-hc-49s/dp/1842268; ComponentLink2Description: datasheet; ComponentLink2URL: http://www.farnell.com/datasheets/1364712.pdf?_ga=2.75608277.197329085.1542397831-1931041576.1541506444; Supplier 1: Farnell; Supplier Part Number 1: 1842268; Manufacturer Part Number 1: 9B-8.000MAAJ-B; Supplier Unit Price 1: 0,453; Supplier Order Qty 1: 1; Value: 8MHz

## Sheet SNES_DRONE_PSU.SchDoc
size A4
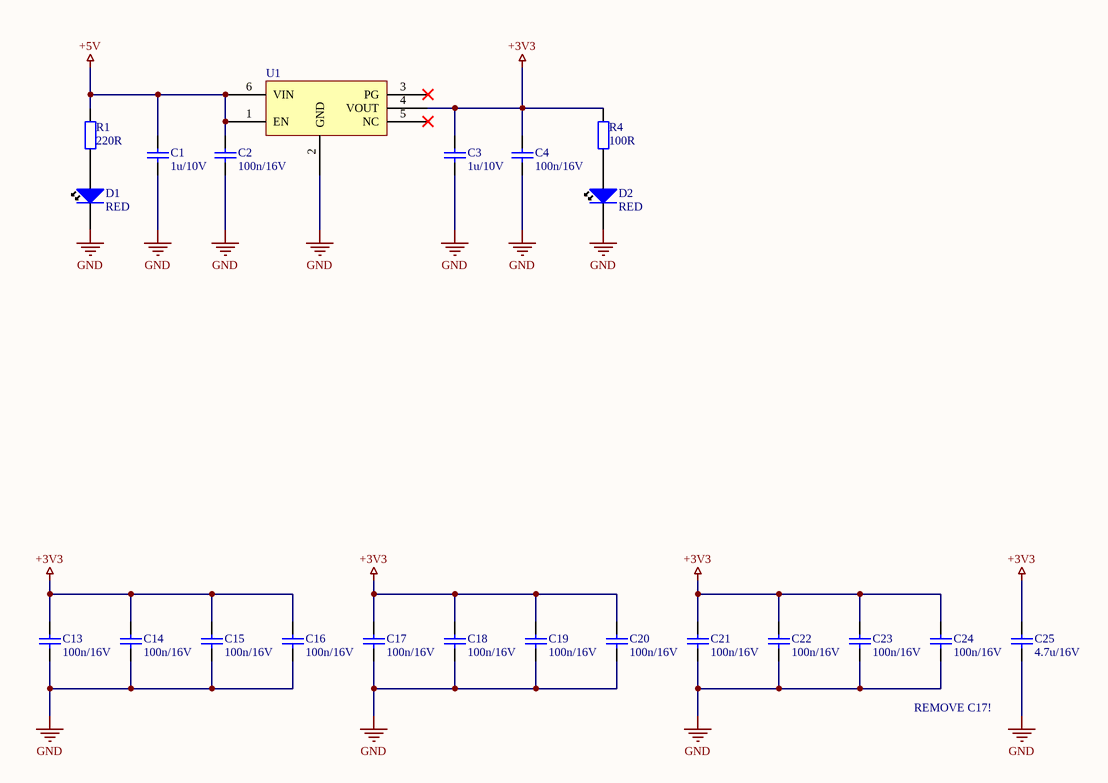
[diagram p4: SNES_DRONE_PSU.SchDoc]

### Parts
C1  1u/10V  [0603_RES]
C2  100n/16V  [0402_RES]
C3  1u/10V  [0603_RES]
C4  100n/16V  [0402_RES]
C13  100n/16V  [0402_RES]
C14  100n/16V  [0402_RES]
C15  100n/16V  [0402_RES]
C16  100n/16V  [0402_RES]
C17  100n/16V  [0402_RES]
C18  100n/16V  [0402_RES]
C19  100n/16V  [0402_RES]
C20  100n/16V  [0402_RES]
C21  100n/16V  [0402_RES]
C22  100n/16V  [0402_RES]
C23  100n/16V  [0402_RES]
C24  100n/16V  [0402_RES]
C25  4.7u/16V  [0603_RES]
D1  value RED  [0603_LED]  (hidden comment: RED LED)
D2  value RED  [0603_LED]  (hidden comment: RED LED)
R1  value 220R  [0603_RES]  (hidden comment: 220Ohm 100mW)
R4  value 100R  [0603_RES]  (hidden comment: 100Ohm 100mW)
U1  3V3 LDO  [DFN6_3x3]  (value not drawn)

### Nets
+3V3: C3.2 C4.2 C13.2 C14.2 C15.2 C16.2 C17.2 C18.2 C19.2 C20.2 C21.2 C22.2 C23.2 C24.2 C25.2 R4.2 U1.4(VOUT)
+5V: C1.2 C2.2 R1.2 U1.1(EN) U1.6(VIN)
GND: C1.1 C2.1 C3.1 C4.1 C13.1 C14.1 C15.1 C16.1 C17.1 C18.1 C19.1 C20.1 C21.1 C22.1 C23.1 C24.1 C25.1 D1.2(K) D2.2(K) U1.2(GND)
NetD1_1: D1.1(A) R1.1
NetD2_1: D2.1(A) R4.1

Not connected (* = marked no-connect by the designer): U1 3(PG)* 5(NC)*

### Notes on the sheet
- REMOVE C17!

### Library data of the parts
C1 C3 = Cap_1u_0603: as C27 on sheet SNES_DRONE_MCU; farnell number: 1166020; datasheet: http://www.farnell.com/datasheets/2046096.pdf?_ga=2.184862249.1080119096.1514547302-1693477411.1514385574; Supplier Unit Price 1: 0,0826; Supplier Order Qty 1: 10; ComponentLink1Description: datasheet; ComponentLink1URL: http://www.farnell.com/datasheets/2031757.pdf?_ga=2.58341487.453785206.1540794792-1293375253.1539206166; ComponentLink2Description: farnell; ComponentLink2URL: https://at.farnell.com/wurth-elektronik/885012106010/kondensator-1-f-10v-20-x5r-0603/dp/2533941?st=1%C2%B5F%20SMD; Supplier 1: Farnell; Supplier Part Number 1: 2533941; Value: 1u/10V
C2 C4 C13-C24 = Cap_100n_0402: as C30 on sheet SNES_DRONE_CART; farnell number: 1759388; datasheet: http://www.farnell.com/datasheets/2046096.pdf?_ga=2.184862249.1080119096.1514547302-1693477411.1514385574; Supplier Unit Price 1: 0,0226; Supplier Order Qty 1: 10; ComponentLink1Description: datasheet; ComponentLink1URL: http://www.farnell.com/datasheets/1901289.pdf?_ga=2.126104776.453785206.1540794792-1293375253.1539206166; ComponentLink2Description: farnell; ComponentLink2URL: https://at.farnell.com/multicomp/mc0402x104k160ct/kondensator-0-1-f-16v-10-x5r-0402/dp/1759388?st=1%C2%B5F%20SMD; Supplier 1: Farnell; Supplier Part Number 1: 1760121; Value: 100n/16V
C25 = Cap_4u7_0603: Keramikvielschichtkondensator, SMD, 4.7 µF, 16 V, 0603 [Metrisch 1608], ± 10%, X5R, Baureihe C; Manufacturer Part Number 1: C1608X5R1C475K080AC; Manufacturer 1: TDK; farnell number: 2211173; datasheet: http://www.farnell.com/datasheets/2046096.pdf?_ga=2.184862249.1080119096.1514547302-1693477411.1514385574; Supplier Unit Price 1: 0,2853; Supplier Order Qty 1: 10; ComponentLink1Description: datasheet; ComponentLink1URL: http://www.farnell.com/datasheets/2291921.pdf?_ga=2.59363432.453785206.1540794792-1293375253.1539206166; ComponentLink2Description: farnell; ComponentLink2URL: https://at.farnell.com/tdk/c1608x5r1c475k080ac/kondensator-4-7-f-16v-10-x5r-0603/dp/2211173; Supplier 1: Farnell; Supplier Part Number 1: 2366559; Value: 4.7u/16V
D1 D2 = LED_RED_0603: as D3 on sheet SNES_DRONE_GPIO; farnell number: 2099221; datasheet: http://www.farnell.com/datasheets/2045911.pdf?_ga=2.71890899.197329085.1542397831-1931041576.1541506444; Supplier Order Qty 1: 5; Supplier Unit Price 1: 0,0686; Supplier 1: Farnell; ComponentLink1Description: datasheet; ComponentLink1URL: http://www.farnell.com/datasheets/2045911.pdf?_ga=2.71890899.197329085.1542397831-1931041576.1541506444; ComponentLink2Description: farnell; ComponentLink2URL: https://at.farnell.com/kingbright/kpt-1608ec/led-rot-0603-smd/dp/2099221; Supplier Part Number 1: 2099221RL
R1 = RES_0603_220_100mW: as R13 on sheet SNES_DRONE_GPIO; Supplier Order Qty 1: 10; Supplier 1: Farnell; ComponentLink1Description: datasheet; ComponentLink1URL: http://www.farnell.com/datasheets/2167052.pdf?_ga=2.63044847.197329085.1542397831-1931041576.1541506444; ComponentLink2Description: farnell; ComponentLink2URL: https://at.farnell.com/yageo/rc0603jr-07220rl/dickschichtwiderstand-220r-5-0/dp/9233296; Manufacturer 1: YAGEO; Supplier Part Number 1: 9233296RL
R4 = RES_0603_100_100mW: as R33 on sheet SNES_DRONE_MCU; Supplier Order Qty 1: 10; Supplier 1: Farnell; ComponentLink1Description: datasheet; ComponentLink1URL: http://www.farnell.com/datasheets/1911175.pdf?_ga=2.135975793.197329085.1542397831-1931041576.1541506444; ComponentLink2Description: farnell; ComponentLink2URL: https://at.farnell.com/panasonic-electronic-components/erj3ekf1000v/dickschichtwiderstand-100r-1-0/dp/2303059; Supplier Part Number 1: 2304564; Manufacturer 1: PANASONIC ELECTRONIC COMPONENTS
U1 = IC_LD39050PU33R: 1.5V bis 5.5V, 200mV Dropout, 3.3Vout/500mAout, DFN-6; Manufacturer 1: STMICROELECTRONICS; ComponentLink1Description: datasheet; ComponentLink1URL: http://www.farnell.com/datasheets/2370074.pdf?_ga=2.122701195.1861125961.1540492103-1293375253.1539206166; ComponentLink2Description: farnell; ComponentLink2URL: https://at.farnell.com/stmicroelectronics/ld39050pu33r/ldo-festspannungsregler-3-3v-05a/dp/2762703?ost=LD39050PU33R&scope=partnumberlookahead&searchref=searchlookahead&krypto=v2O8xpEkDJEehvbX%2FqTLShvehAxaR7YbrljqfXBDfuj50zIfUNJeDFxoc2A0Cze08nzHIR4SF3CGrRPxKfCBL9N4Yq42Uy500A7%2FEdTt8dRzgOzw%2Fj8TwoNTEnMHnxO5P9nblZl0nzcfLW4eKl3g9jkyXKFZo%2F%2F3gERokDoSJd1daTFFRRG4RHWY%2Faw5mstGXXVWChlIPClwUAfBvs7lsEkRRi3L6BEEcjGgbxAmuoyjrflm7W2cmCmFAOX3jxKSRrOL8bJdTwNoMSzZ80NlaqzDSklx7xUjpCCk0RrUqrhS2rfn8XOS9ekSGIN0jisMQ6yjxseOFahLMnID9YfMZLLrejIw7PCACE1KH5QrAhyB26QC6ydHdbiQWH38XibCYFlNF97wsMPhACNpyLVOfvihx8YctuoiihZPzzNLaWIIhos8bwZ1UCOH2zQQRLrAeq2frwHKfhpeRWeoHaU5KdzS3UWiDRDfxbAEMyuoNh2cSvLml6uU0JaqTtRq9XRhe4o8m2xstAETCiIEjA%2FYjMpxUs0LrbliBVEf%2Fd68ExGXwImciRdIZuwzcLHVr7kACefKmRIghVm8Cat3FppUfM3dD2yHupMFxuFRTHI4kG8%3D&ddkey=https%3Ade-AT%2FElement14_Austria%2Fw%2Fsearch; Supplier 1: Farnell; Supplier Part Number 1: 2762703; Manufacturer Part Number 1: LD39050PU33R; Supplier Unit Price 1: 0,915; Supplier Order Qty 1: 1

## Nets that join several sheets
+3V3: SNES_DRONE_CART (C31.1 U4.24), SNES_DRONE_GPIO (11 pins), SNES_DRONE_MCU (21 pins), SNES_DRONE_PSU (17 pins)
+5V: SNES_DRONE_CART (5 pins), SNES_DRONE_GPIO (D3.1 J10.1), SNES_DRONE_PSU (5 pins)
GND: SNES_DRONE_CART (9 pins), SNES_DRONE_GPIO (31 pins), SNES_DRONE_MCU (24 pins), SNES_DRONE_PSU (20 pins)
ADR0: SNES_DRONE_CART (J1.17), SNES_DRONE_MCU (U2.10)
ADR1: SNES_DRONE_CART (J1.16), SNES_DRONE_MCU (U2.11)
ADR2: SNES_DRONE_CART (J1.15), SNES_DRONE_MCU (U2.12)
ADR3: SNES_DRONE_CART (J1.14), SNES_DRONE_MCU (U2.13)
ADR4: SNES_DRONE_CART (J1.13), SNES_DRONE_MCU (U2.14)
ADR5: SNES_DRONE_CART (J1.12), SNES_DRONE_MCU (U2.15)
ADR6: SNES_DRONE_CART (J1.11), SNES_DRONE_MCU (U2.18)
ADR7: SNES_DRONE_CART (J1.10), SNES_DRONE_MCU (U2.19)
ADR8: SNES_DRONE_CART (J1.9), SNES_DRONE_MCU (U2.20)
ADR9: SNES_DRONE_CART (J1.8), SNES_DRONE_MCU (U2.21)
ADR10: SNES_DRONE_CART (J1.7), SNES_DRONE_MCU (U2.22)
ADR11: SNES_DRONE_CART (J1.6), SNES_DRONE_MCU (U2.49)
ADR12: SNES_DRONE_CART (J1.37), SNES_DRONE_MCU (U2.50)
ADR13: SNES_DRONE_CART (J1.38), SNES_DRONE_MCU (U2.53)
ADR14: SNES_DRONE_CART (J1.39), SNES_DRONE_MCU (U2.54)
ADR15: SNES_DRONE_CART (J1.40), SNES_DRONE_MCU (U2.55)
ADR16: SNES_DRONE_CART (J1.41), SNES_DRONE_MCU (U2.56)
ADR17: SNES_DRONE_CART (J1.42), SNES_DRONE_MCU (U2.57)
ADR18: SNES_DRONE_CART (J1.43), SNES_DRONE_MCU (U2.87)
ADR19: SNES_DRONE_CART (J1.44), SNES_DRONE_MCU (U2.88)
ADR20: SNES_DRONE_CART (J1.45), SNES_DRONE_MCU (U2.89)
ADR21: SNES_DRONE_CART (J1.46), SNES_DRONE_MCU (U2.90)
ADR22: SNES_DRONE_CART (J1.47), SNES_DRONE_MCU (U2.91)
ADR23: SNES_DRONE_CART (J1.48), SNES_DRONE_MCU (U2.92)
BTN0: SNES_DRONE_GPIO (J11.2 R9.2), SNES_DRONE_MCU (U2.101)
BTN1: SNES_DRONE_GPIO (J11.3 R10.2), SNES_DRONE_MCU (U2.102)
BTN2: SNES_DRONE_GPIO (J11.4 R11.2), SNES_DRONE_MCU (U2.103)
BTN3: SNES_DRONE_GPIO (R13.2), SNES_DRONE_MCU (U2.104)
DATA0: SNES_DRONE_CART (U4.21), SNES_DRONE_MCU (U2.114)
DATA1: SNES_DRONE_CART (U4.20), SNES_DRONE_MCU (U2.115)
DATA2: SNES_DRONE_CART (U4.19), SNES_DRONE_MCU (U2.116)
DATA3: SNES_DRONE_CART (U4.18), SNES_DRONE_MCU (U2.117)
DATA4: SNES_DRONE_CART (U4.17), SNES_DRONE_MCU (U2.118)
DATA5: SNES_DRONE_CART (U4.16), SNES_DRONE_MCU (U2.119)
DATA6: SNES_DRONE_CART (U4.15), SNES_DRONE_MCU (U2.122)
DATA7: SNES_DRONE_CART (U4.14), SNES_DRONE_MCU (U2.123)
GPIO0: SNES_DRONE_GPIO (R19.1 R26.2), SNES_DRONE_MCU (U2.70)
GPIO1: SNES_DRONE_GPIO (R21.1 R27.2), SNES_DRONE_MCU (U2.73)
GPIO2: SNES_DRONE_GPIO (R23.1 R28.2), SNES_DRONE_MCU (U2.74)
GPIO3: SNES_DRONE_GPIO (R25.1 R29.2), SNES_DRONE_MCU (U2.75)
MCU_POT0: SNES_DRONE_GPIO (C5.2 P1.2), SNES_DRONE_MCU (U2.46)
MCU_POT1: SNES_DRONE_GPIO (C6.2 P2.2), SNES_DRONE_MCU (U2.47)
MCU_POT2: SNES_DRONE_GPIO (C7.2 P3.2), SNES_DRONE_MCU (U2.26)
MCU_POT3: SNES_DRONE_GPIO (C8.2 P4.2), SNES_DRONE_MCU (U2.27)
MCU_POT4: SNES_DRONE_GPIO (C9.2 P5.2), SNES_DRONE_MCU (U2.28)
MCU_POT5: SNES_DRONE_GPIO (C10.2 P6.2), SNES_DRONE_MCU (U2.29)
MCU_POT6: SNES_DRONE_GPIO (C11.2 P7.2), SNES_DRONE_MCU (U2.44)
MCU_POT7: SNES_DRONE_GPIO (C12.2 P8.2), SNES_DRONE_MCU (U2.45)
MCU_USR_LED: SNES_DRONE_GPIO (R31.1 R32.2), SNES_DRONE_MCU (U2.76)
NetJ1_18: SNES_DRONE_CART (J1.18), SNES_DRONE_MCU (U2.37)
NetJ1_23: SNES_DRONE_CART (J1.23), SNES_DRONE_MCU (U2.41)
NetJ1_26: SNES_DRONE_CART (J1.26), SNES_DRONE_MCU (U2.43)
NetJ1_49: SNES_DRONE_CART (J1.49), SNES_DRONE_MCU (U2.40)
NetJ1_54: SNES_DRONE_CART (J1.54), SNES_DRONE_MCU (U2.42)
NetJ1_57: SNES_DRONE_CART (J1.57), SNES_DRONE_MCU (U2.100)
NetU2_35: SNES_DRONE_CART (U4.22), SNES_DRONE_MCU (U2.35)
NetU2_36: SNES_DRONE_CART (U4.2), SNES_DRONE_MCU (U2.36)